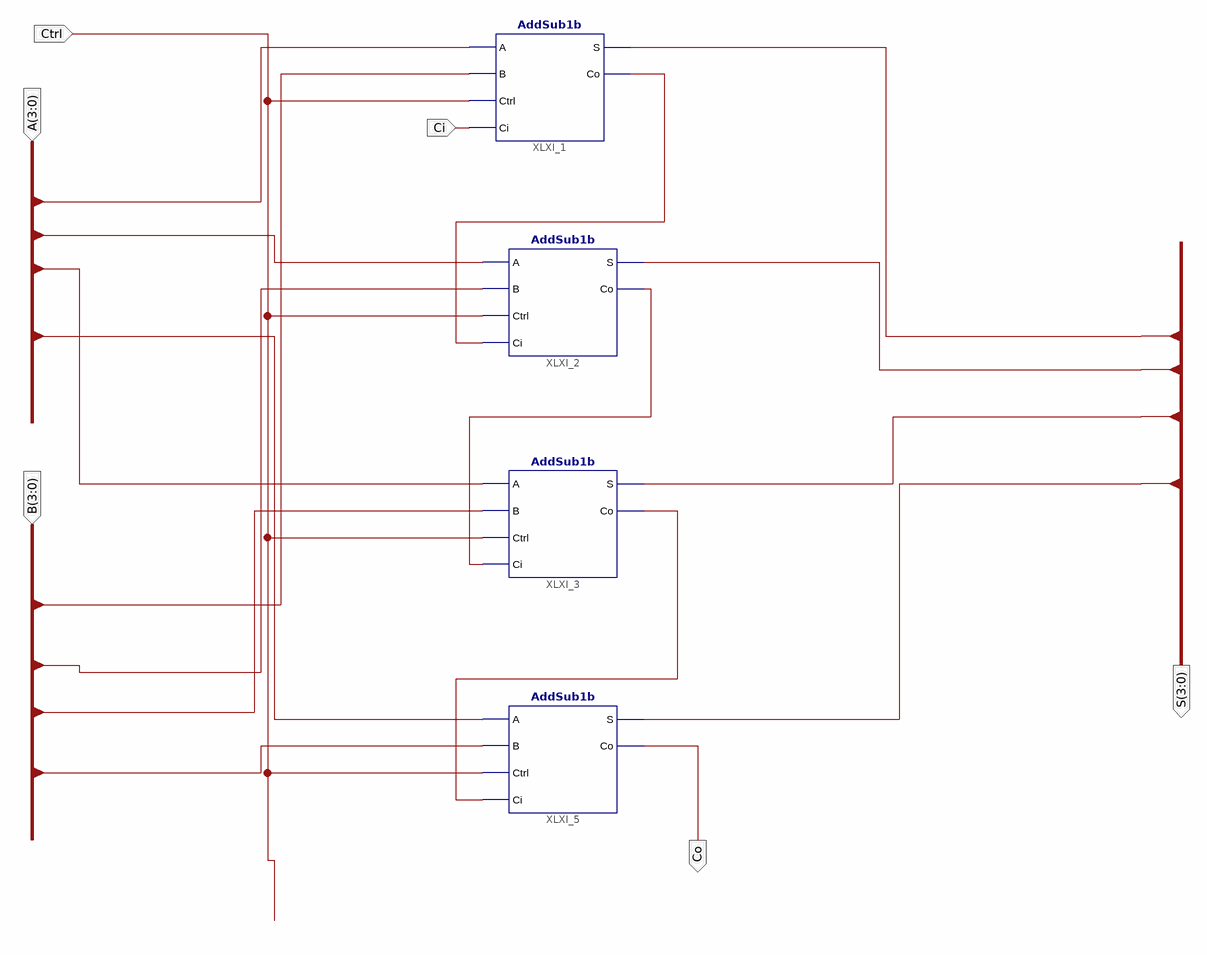
[diagram p0: schematic sheet 1]
// Xilinx ISE schematic AddSub4b.sch (kintex7) as structural Verilog: 4 symbols, 6 ports
module AddSub4b (
  input  [3:0] A,
  input  [3:0] B,
  input  Ctrl,
  input  Ci,
  output [3:0] S,
  output Co
);

  wire XLXN_12, XLXN_13, XLXN_16;

  AddSub1b XLXI_1 (.A(A[0]), .B(B[0]), .Ci(Ci), .Co(XLXN_12), .Ctrl(Ctrl), .S(S[0]));
  AddSub1b XLXI_2 (.A(A[1]), .B(B[1]), .Ci(XLXN_12), .Co(XLXN_16), .Ctrl(Ctrl), .S(S[1]));
  AddSub1b XLXI_3 (.A(A[2]), .B(B[2]), .Ci(XLXN_16), .Co(XLXN_13), .Ctrl(Ctrl), .S(S[2]));
  AddSub1b XLXI_5 (.A(A[3]), .B(B[3]), .Ci(XLXN_13), .Co(Co), .Ctrl(Ctrl), .S(S[3]));
endmodule
